# Altium schematic sheet I2C.SchDoc: I2C
size A4; Date: 04/19/2026; Author: Lanfroid-Nazac Guillaume; DrawnBy: Lanfroid-Nazac Guillaume; Revision: v1.0; SheetNumber: 6; SheetTotal: 8
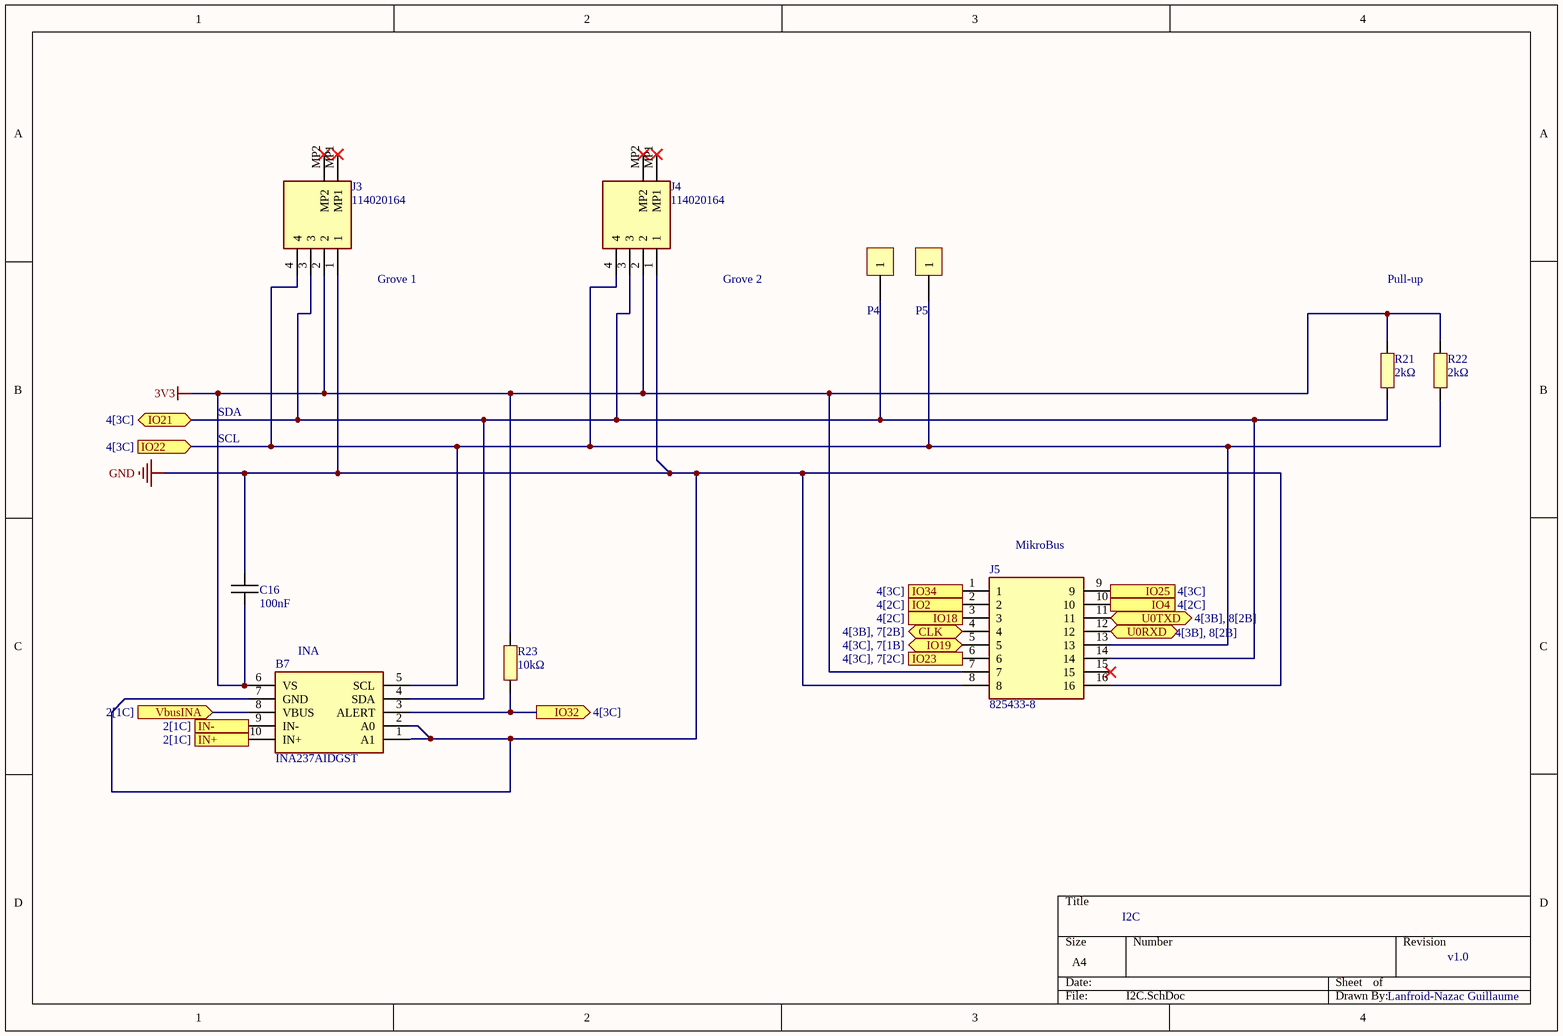
[diagram p0: I2C.SchDoc]

## Parts
B7  INA237AIDGST  [SOP50P490X110-10N]
C16  100nF  [CAPC1005X06N]
J3  114020164  [114020164]
J4  114020164  [114020164]
J5  825433-8  [Connect-Mikrobus]
P4  Plage CMS 10x5  [Plage CMS 10x5]  (value not drawn)  (no BOM)
P5  Plage CMS 10x5  [Plage CMS 10x5]  (value not drawn)  (no BOM)
R21  2kΩ  [RESC1005X06N]
R22  2kΩ  [RESC1005X06N]
R23  10kΩ  [RESC1005X06N]

## Ports
CLK (bidir, see 4[3B], 7[2B]), IN+ (in, see 2[1C]), IN- (in, see 2[1C]), IO2 (out, see 4[2C]), IO4 (in, see 4[2C]), IO18 (out, see 4[2C]), IO19 (bidir, see 4[3C], 7[1B]), IO21 (bidir, see 4[3C]), IO22 (in, see 4[3C]), IO23 (out, see 4[3C], 7[2C]), IO25 (out, see 4[3C]), IO32 (out, see 4[3C]), IO34 (in, see 4[3C]), U0RXD (bidir, see 4[3B], 8[2B]), U0TXD (bidir, see 4[3B], 8[2B]), VbusINA (in, see 2[1C])

## Nets
3V3: B7.6(VS) C16.1 J3.2 J4.2 J5.7 R21.1 R22.1 R23.1
GND: B7.1(A1) B7.2(A0) B7.7(GND) C16.2 J3.1 J4.1 J5.8 J5.16
CLK: J5.4 ; port CLK
IN+: B7.10(IN+) ; port IN+
IN-: B7.9(IN-) ; port IN-
IO2: J5.2 ; port IO2
IO4: J5.10 ; port IO4
IO18: J5.3 ; port IO18
IO19: J5.5 ; port IO19
IO21: B7.4(SDA) J3.3 J4.3 J5.14 P4.1 R21.2 ; port IO21
IO22: B7.5(SCL) J3.4 J4.4 J5.13 P5.1 R22.2 ; port IO22
IO23: J5.6 ; port IO23
IO25: J5.9 ; port IO25
IO32: B7.3(ALERT) R23.2 ; port IO32
IO34: J5.1 ; port IO34
U0RXD: J5.12 ; port U0RXD
U0TXD: J5.11 ; port U0TXD
VbusINA: B7.8(VBUS) ; port VbusINA

Not connected (* = marked no-connect by the designer): J3 MP1* MP2*; J4 MP1* MP2*; J5 15*

## Notes on the sheet
- (near J3) Grove 1
- Grove 2
- Pull-up
- SDA
- SCL
- (near J5) MikroBus
- (near B7) INA

## Library data of the parts
B7 = INA237AIDGST: Current Sense Amplifiers 85-V, 16-bit, I2C output current/voltage/power monitor with alert 10-VSSOP -40 to 125; Manufacturer_Name: Texas Instruments; Manufacturer_Part_Number: INA237AIDGST; Mouser Part Number: 595-INA237AIDGST
C16 = Capacitor
J3 J4 = 114020164: Seeed Studio Accessories Grove Female Header - SMD-4P-2.0mm-90D-20Pcs; Manufacturer_Name: Seeed Studio; Manufacturer_Part_Number: 114020164; Mouser Part Number: 713-114020164
J5 = Connect-Mikrobus: Headers & Wire Housings 8P double for connection mikrobus; Manufacturer_Name: TE Connectivity; Manufacturer_Part_Number: 825433-8; Mouser Part Number: 571-825433-8
P4 P5 = Plage CMS 10x5: Plage de report CMS 10x5mm; PN: L30; Value: Plage CMS 10x5; Footprint_statut: ok
R21-R23 = Resistor